# EAGLE design DCCGen_ATMEGA_V5 (EAGLE 6.2)
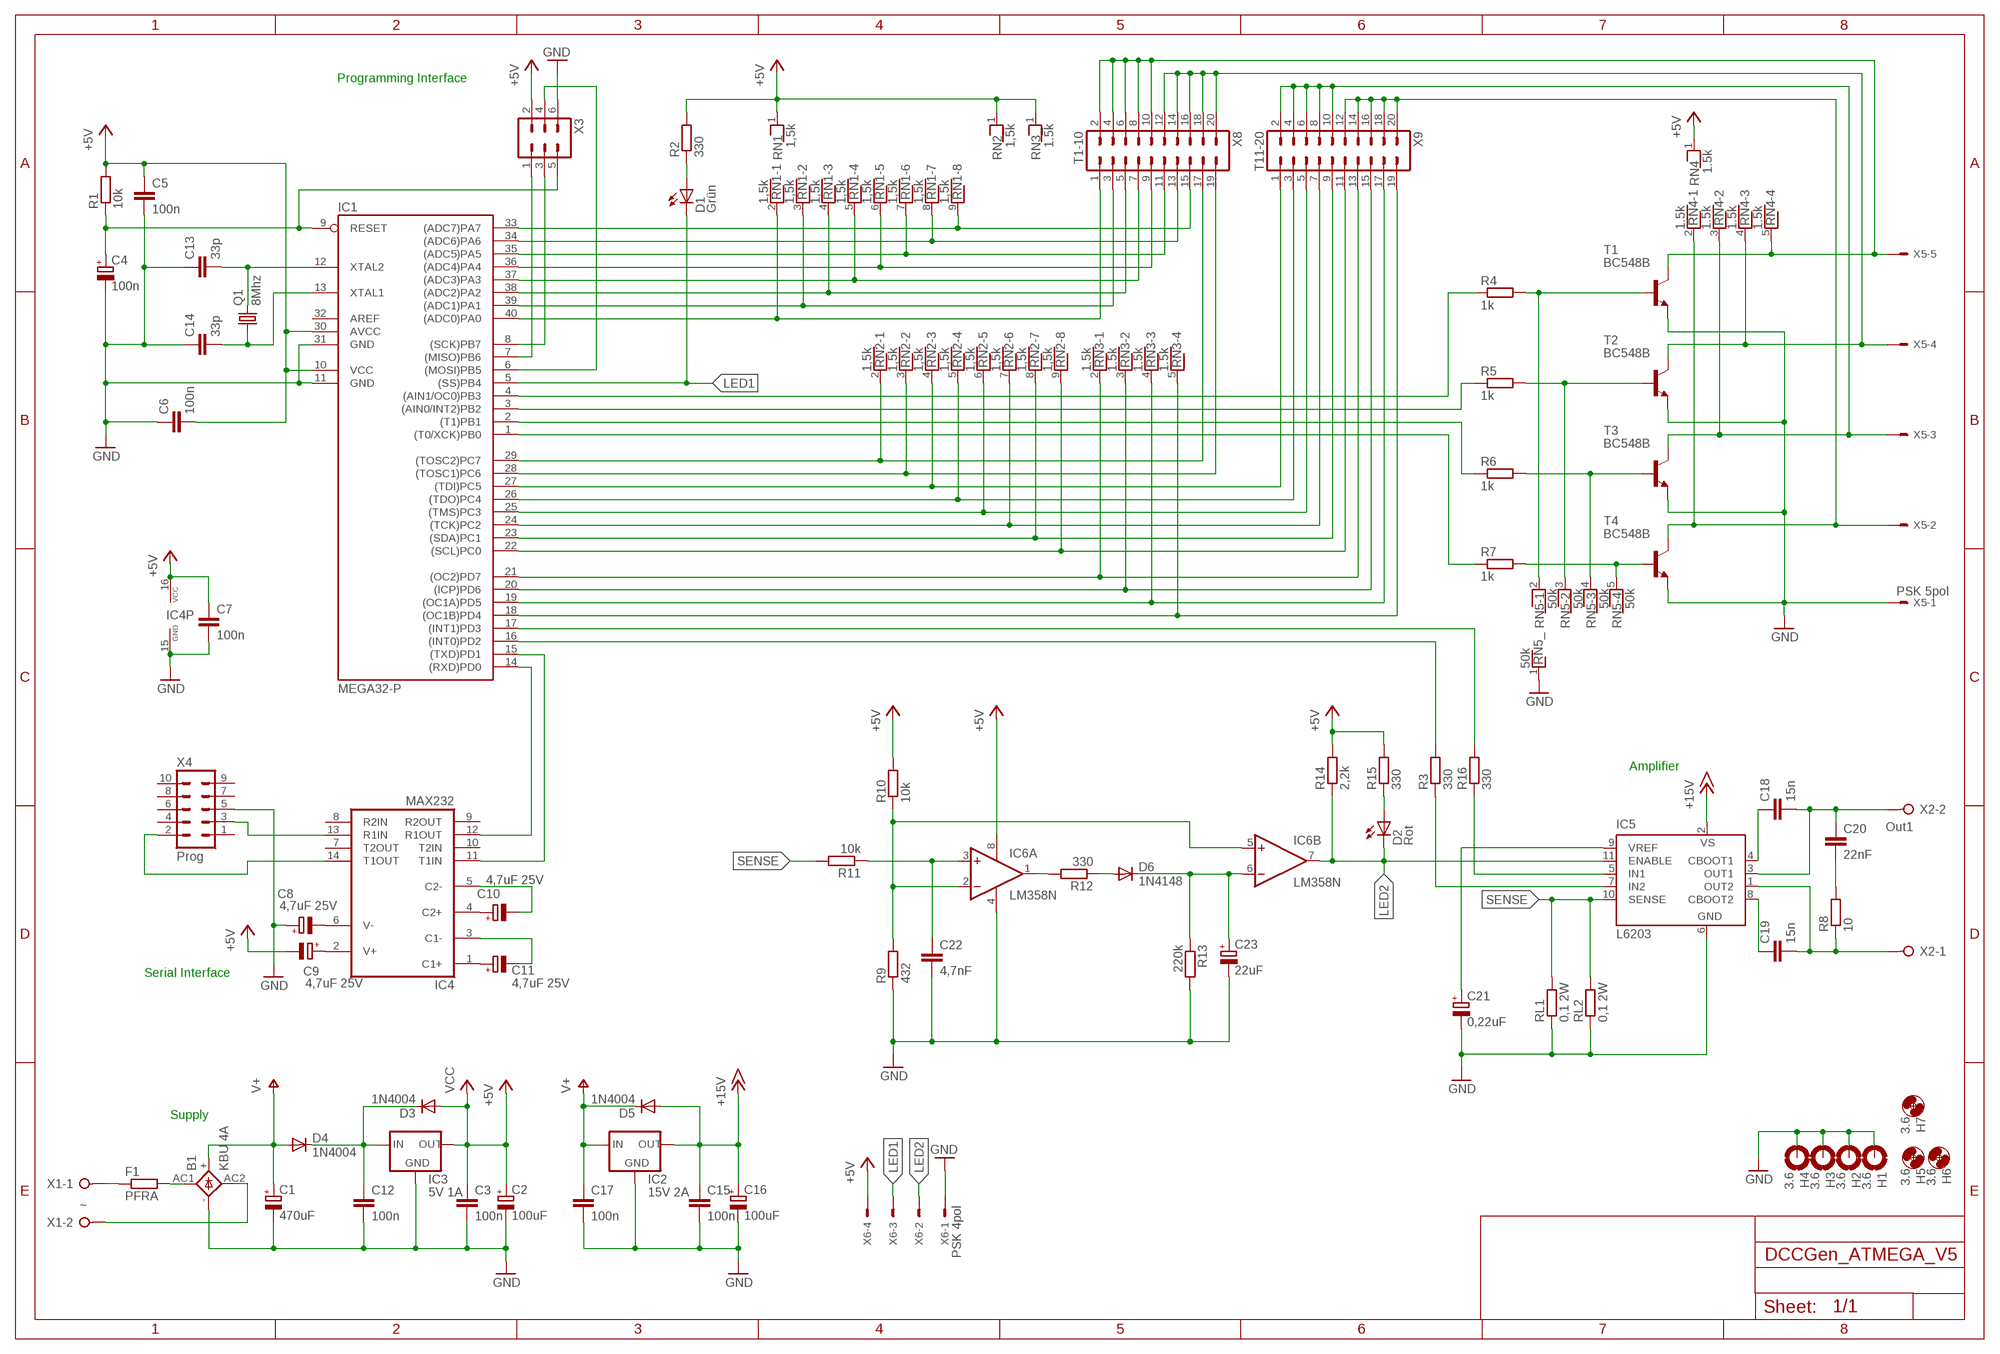
[diagram p0: schematic, sheet 1]

## Parts
B1  KBU 4A  KBU  [KBU]
C1  470uF  CPOL-EUE5-13  [E5-13]
C2  100uF  CPOL-EUE2.5-7  [E2,5-7]
C3  100n  C-EU025-025X050  [C025-025X050]
C4  100n  CPOL-EUE2.5-5  [E2,5-5]
C5  100n  C-EU025-025X050  [C025-025X050]
C6  100n  C-EU025-025X050  [C025-025X050]
C7  100n  C-EU025-025X050  [C025-025X050]
C8  4,7uF 25V  CPOL-EUE2,5-6E  [E2,5-6E]
C9  4,7uF 25V  CPOL-EUE2,5-6E  [E2,5-6E]
C10  4,7uF 25V  CPOL-EUE2,5-6E  [E2,5-6E]
C11  4,7uF 25V  CPOL-EUE2,5-6E  [E2,5-6E]
C12  100n  C-EU025-025X050  [C025-025X050]
C13  33p  C-EU025-025X050  [C025-025X050]
C14  33p  C-EU025-025X050  [C025-025X050]
C15  100n  C-EU025-025X050  [C025-025X050]
C16  100uF  CPOL-EUE2.5-7  [E2,5-7]
C17  100n  C-EU025-025X050  [C025-025X050]
C18  15n  C-EU025-025X050  [C025-025X050]
C19  15n  C-EU025-025X050  [C025-025X050]
C20  22nF  C-EU025-025X050  [C025-025X050]
C21  0,22uF  CPOL-EUE2-5  [E2-5]
C22  4,7nF  C-EU025-025X050  [C025-025X050]
C23  22uF  CPOL-EUE2-5  [E2-5]
D1  Grün  LED3MM  [LED3MM]
D2  Rot  LED3MM  [LED3MM]
D3  1N4004  [DO41-10]
D4  1N4004  [DO41-10]
D5  1N4004  [DO41-10]
D6  1N4148  1N4148DO35-10  [DO35-10]
F1  PFRA  R-EU_0204/5  [0204/5]
H1  3.6  MOUNT-PAD-ROUND3.6  [3,6-PAD]
H2  3.6  MOUNT-PAD-ROUND3.6  [3,6-PAD]
H3  3.6  MOUNT-PAD-ROUND3.6  [3,6-PAD]
H4  3.6  MOUNT-PAD-ROUND3.6  [3,6-PAD]
H5  3.6  MOUNT-HOLE3.6  [3,6]
H6  3.6  MOUNT-HOLE3.6  [3,6]
H7  3.6  MOUNT-HOLE3.6  [3,6]
IC1  MEGA32-P  [DIL40]
IC2  15V 2A  78XXS  [78XXS]
IC3  5V 1A  78XXS  [78XXS]
IC4  MAX232  [DIL16]
IC5  L6203  [MULTIWATT-11]
IC6  LM358N  [DIL08]
Q1  8Mhz  CRYSTALHC49U-V  [HC49U-V]
R1  10k  R-EU_0207/10  [0207/10]
R2  330  R-EU_0207/10  [0207/10]
R3  330  R-EU_0207/10  [0207/10]
R4  1k  R-EU_0207/10  [0207/10]
R5  1k  R-EU_0207/10  [0207/10]
R6  1k  R-EU_0207/10  [0207/10]
R7  1k  R-EU_0207/10  [0207/10]
R8  10  R-EU_0207/10  [0207/10]
R9  432  R-EU_0207/10  [0207/10]
R10  10k  R-EU_0207/10  [0207/10]
R11  10k  R-EU_0207/10  [0207/10]
R12  330  R-EU_0207/10  [0207/10]
R13  220k  R-EU_0207/10  [0207/10]
R14  2,2k  R-EU_0207/10  [0207/10]
R15  330  R-EU_0207/10  [0207/10]
R16  330  R-EU_0207/10  [0207/10]
RL1  0,1 2W  R-EU_0617/17  [0617/17]
RL2  0,1 2W  R-EU_0617/17  [0617/17]
RN1  1,5k  RNX8  [RN-9]
RN2  1,5k  RNX8  [RN-9]
RN3  1.5k  RNX4  [RN-5]
RN4  1.5k  RNX4  [RN-5]
RN5  50k  RNX4  [RN-5]
T1  BC548B  [TO92-EBC]
T2  BC548B  [TO92-EBC]
T3  BC548B  [TO92-EBC]
T4  BC548B  [TO92-EBC]
X1  ~  W237-02P  [W237-132]
X2  Out1  W237-02P  [W237-132]
X3  ML6  [ML6]
X4  Prog  ML10  [ML10]
X5  PSK 5pol  22-27-2051-05  [6410-05]
X6  PSK 4pol  22-27-2041-04  [6410-04]
X8  T1-10  ML20  [ML20]
X9  T11-20  ML20  [ML20]

## Nets
+5V: C2.+ C3.1 C5.1 C6.2 C7.1 C9.- D3.A IC1.10(VCC) IC1.30(AVCC) IC3.OUT IC4.16(VCC) IC6.8(P:V+) R1.2 R2.2 R10.2 R14.2 R15.2 RN1.1 RN2.1 RN3.1 RN4.1 X3.2 X6.4 ; supply symbol labelled VCC
+15V: C15.1 C16.+ D5.A IC2.OUT IC5.2(VS)
GND: B1.- C1.- C2.- C3.2 C4.- C5.2 C6.1 C7.2 C8.+ C12.2 C13.1 C14.1 C15.2 C16.- C17.2 C21.- C22.2 C23.- H1.B3,6(MOUNT) H2.B3,6(MOUNT) H3.B3,6(MOUNT) H4.B3,6(MOUNT) IC1.11(GND) IC1.31(GND) IC2.GND IC3.GND IC4.15(GND) IC5.6(GND) IC6.4(P:V-) R9.1 R13.2 RL1.1 RL2.1 RN5.1 T1.E T2.E T3.E T4.E X3.6 X4.5 X5.1 X6.1
LED1: D1.K(C) IC1.5((SS)PB4) X6.3
LED2: D2.K(C) IC5.11(ENABLE) IC6.7(B:OUT) R14.1 X6.2
N$1: F1.1 X1.1
N$2: B1.AC2 X1.2
N$3: IC1.6((MOSI)PB5) X3.4
N$4: IC1.8((SCK)PB7) X3.3
N$5: IC1.7((MISO)PB6) X3.1
N$6: IC1.40((ADC0)PA0) RN1.2 X8.1
N$7: IC1.39((ADC1)PA1) RN1.3 X8.3
N$8: IC1.38((ADC2)PA2) RN1.4 X8.5
N$9: C4.+ IC1.9(RESET) R1.1 X3.5
N$10: IC1.37((ADC3)PA3) RN1.5 X8.7
N$11: IC1.36((ADC4)PA4) RN1.6 X8.9
N$12: IC1.35((ADC5)PA5) RN1.7 X8.11
N$13: IC1.34((ADC6)PA6) RN1.8 X8.13
N$14: IC1.33((ADC7)PA7) RN1.9 X8.15
N$15: C14.2 IC1.13(XTAL1) Q1.1
N$16: C12.1 D3.C D4.C IC3.IN
N$17: D1.A R2.1
N$19: IC1.29((TOSC2)PC7) RN2.2 X8.17
N$20: IC1.28((TOSC1)PC6) RN2.3 X8.19
N$21: IC1.27((TDI)PC5) RN2.4 X9.1
N$22: C21.+ IC5.9(VREF)
N$23: IC1.26((TDO)PC4) RN2.5 X9.3
N$24: IC6.2(A:-IN) IC6.5(B:+IN) R9.2 R10.1
N$25: C22.1 IC6.3(A:+IN) R11.1
N$26: C20.2 R8.2
N$27: IC1.17((INT1)PD3) R16.2
N$28: IC1.16((INT0)PD2) R3.2
N$29: C18.2 C20.1 IC5.3(OUT1) X2.2
N$30: C18.1 IC5.4(CBOOT1)
N$31: IC1.15((TXD)PD1) IC4.11(T1IN)
N$32: IC1.14((RXD)PD0) IC4.12(R1OUT)
N$33: C8.- IC4.6(V-)
N$34: C9.+ IC4.2(V+)
N$35: IC4.14(T1OUT) X4.2
N$36: C11.+ IC4.1(C1+)
N$37: C11.- IC4.3(C1-)
N$38: C10.+ IC4.4(C2+)
N$39: C10.- IC4.5(C2-)
N$40: IC4.13(R1IN) X4.3
N$42: IC1.25((TMS)PC3) RN2.6 X9.5
N$43: B1.AC1 F1.2
N$44: IC1.24((TCK)PC2) RN2.7 X9.7
N$45: IC1.23((SDA)PC1) RN2.8 X9.9
N$47: IC1.22((SCL)PC0) RN2.9 X9.11
N$48: IC1.21((OC2)PD7) RN3.2 X9.13
N$49: IC1.20((ICP)PD6) RN3.3 X9.15
N$50: IC1.19((OC1A)PD5) RN3.4 X9.17
N$51: IC1.18((OC1B)PD4) RN3.5 X9.19
N$52: IC5.7(IN2) R3.1
N$53: IC5.5(IN1) R16.1
N$56: RN4.2 T4.C X5.2 X9.12 X9.14 X9.16 X9.18 X9.20
N$57: IC1.2((T1)PB1) R6.1
N$58: IC1.1((T0/XCK)PB0) R7.1
N$60: IC1.4((AIN1/OC0)PB3) R4.1
N$61: IC1.3((AIN0/INT2)PB2) R5.1
N$63: R4.2 RN5.2 T1.B
N$64: R5.2 RN5.3 T2.B
N$65: R6.2 RN5.4 T3.B
N$66: R7.2 RN5.5 T4.B
N$67: C13.2 IC1.12(XTAL2) Q1.2
N$68: C19.1 IC5.8(CBOOT2)
N$69: C19.2 IC5.1(OUT2) R8.1 X2.1
N$70: IC6.1(A:OUT) R12.2
N$72: C23.+ D6.C IC6.6(B:-IN) R13.1
N$73: D6.A R12.1
N$74: RN4.5 T1.C X5.5 X8.2 X8.4 X8.6 X8.8 X8.10
N$75: RN4.4 T2.C X5.4 X8.12 X8.14 X8.16 X8.18 X8.20
N$76: RN4.3 T3.C X5.3 X9.2 X9.4 X9.6 X9.8 X9.10
N$77: D2.A R15.1
SENSE: IC5.10(SENSE) R11.2 RL1.2 RL2.2
V+: B1.+ C1.+ C17.1 D4.A D5.C IC2.IN
Unconnected: IC1.32(AREF) IC4.7(T2OUT) IC4.8(R2IN) IC4.9(R2OUT) IC4.10(T2IN) X4.1 X4.4 X4.6 X4.7 X4.8 X4.9 X4.10

## Notes on the sheet
- Programming Interface
- Amplifier
- Serial Interface
- Supply

## Library data of the parts
B1 = rectifier:KBU: DIOTEC RECTIFIER
C1 C2 C4 C8-C11 C16 C21 C23 = rcl:CPOL-EU: POLARIZED CAPACITOR, European symbol
C3 C5-C7 C12-C15 C17-C20 C22 = rcl:C-EU: CAPACITOR, European symbol
D1 D2 = led:LED: LED OSRAM: - CHIPLED LG R971, LG N971, LY N971, LG Q971, LY Q971, LO R971, LY R971 LH N974, LH R974 LS Q976, LO Q976, LY Q976 LO Q996 - Hyper CHIPLED LW Q18S LB Q993, LB Q99A, LB R99A - SideLED LS A670, LO A670, LY A670, LG A670, LP A670 LB A673, LV A673, LT A673, LW A673 LH A674 LY A675 LS A676, LA A676, LO A676, LY A676, LW A676 LS A679, LY A679, LG A679 - Hyper Micro SIDELED® LS Y876, LA Y876, LO Y876, LY Y876 LT Y87S - SmartLED LW L88C, LW L88S LB L89C, LB L89S, LG L890 LS L89K, LO L89K, LY L89K LS L896, LA L896, LO L896, LY L896 - TOPLED LS T670, LO T670, LY T670, LG T670, LP T670 LSG T670, LSP T670, LSY T670, LOP T670, LYG T670 LG T671, LOG T671, LSG T671 LB T673, LV T673, LT T673, LW T673 LH T674 LS T676, LA T676, LO T676, LY T676, LB T676, LH T676, LSB T676, LW T676 LB T67C, LV T67C, LT T67C, LS T67K, LO T67K, LY T67K, LW E67C LS E67B, LA E67B, LO E67B, LY E67B, LB E67C, LV E67C, LT E67C LW T67C LS T679, LY T679, LG T679 LS T770, LO T770, LY T770, LG T770, LP T770 LB T773, LV T773, LT T773, LW T773 LH T774 LS E675, LA E675, LY E675, LS T675 LS T776, LA T776, LO T776, LY T776, LB T776 LHGB T686 LT T68C, LB T68C - Hyper Mini TOPLED® LB M676 - Mini TOPLED Santana® LG M470 LS M47K, LO M47K, LY M47K Source: http://www.osram.convergy.de LUXEON: - LUMILED® LXK2-PW12-R00, LXK2-PW12-S00, LXK2-PW14-U00, LXK2-PW14-V00 LXK2-PM12-R00, LXK2-PM12-S00, LXK2-PM14-U00 LXK2-PE12-Q00, LXK2-PE12-R00, LXK2-PE12-S00, LXK2-PE14-T00, LXK2-PE14-U00 LXK2-PB12-K00, LXK2-PB12-L00, LXK2-PB12-M00, LXK2-PB14-N00, LXK2-PB14-P00, LXK2-PB14-Q00 LXK2-PR12-L00, LXK2-PR12-M00, LXK2-PR14-Q00, LXK2-PR14-R00 LXK2-PD12-Q00, LXK2-PD12-R00, LXK2-PD12-S00 LXK2-PH12-R00, LXK2-PH12-S00 LXK2-PL12-P00, LXK2-PL12-Q00, LXK2-PL12-R00 Source: www.luxeon.com KINGBRIGHT: KA-3528ASYC Source: www.kingbright.com
D3-D5 = diode:1N4004: DIODE general purpose rectifier, 1 A
D6 = diode:1N4148: DIODE high speed (Philips)
F1 R1-R16 RL1 RL2 = rcl:R-EU_: RESISTOR, European symbol
H1-H4 = holes:MOUNT-PAD-ROUND: MOUNTING PAD, round
H5-H7 = holes:MOUNT-HOLE: MOUNTING HOLE with drill center marker
IC1 = atmel:MEGA32-P: MICROCONTROLLER 32 Kbytes FLASH 2 Kbytes SRAM 1 Kbytes EEPROM USART 8-channel 10 bit ADC Source: www.atmel.com .. doc2503.pdf; MPN: ATMEGA32-16PU; OC_FARNELL: 1661729; OC_NEWARK: 51P1794
IC2 IC3 = v-reg:78XXS: VOLTAGE REGULATOR
IC4 = maxim:MAX232: RS232 TRANSEIVER
IC5 = st-microelectronics:L6203: DMOS FULL BRIDGE DRIVER; MPN: L6203; OC_FARNELL: 1467715; OC_NEWARK: 56P8434
IC6 = linear:LM358: OP AMP also LM158; LM258; LM2904 Source: http://cache.national.com/ds/LM/LM158.pdf
Q1 = crystal:CRYSTAL: CRYSTAL; OC_FARNELL: 1666969; OC_NEWARK: unknown
RN1 RN2 = resistor-net:RNX8: RESISTOR NETWORK; OC_FARNELL: unknown; OC_NEWARK: unknown
RN3-RN5 = resistor-net:RNX4: RESISTOR NETWORK; OC_FARNELL: unknown; OC_NEWARK: unknown
T1-T4 = transistor-npn:BC548*: NPN Transistor
X1 X2 = con-wago-508:W237-02P: WAGO SREW CLAMP; OC_FARNELL: unknown; OC_NEWARK: unknown
X3 = con-ml:ML6: HARTING; OC_FARNELL: unknown; OC_NEWARK: unknown
X4 = con-ml:ML10: HARTING; OC_FARNELL: unknown; OC_NEWARK: unknown
X5 = con-molex:22-?-05: CONNECTOR wire to board 2.54 mm (.1 inch) pitch header; OC_FARNELL: unknown; OC_NEWARK: unknown
X6 = con-molex:22-?-04: CONNECTOR wire to board 2.54 mm (.1 inch) pitch header; OC_FARNELL: unknown; OC_NEWARK: unknown
X8 X9 = con-ml:ML20: HARTING; OC_FARNELL: unknown; OC_NEWARK: unknown

## Board
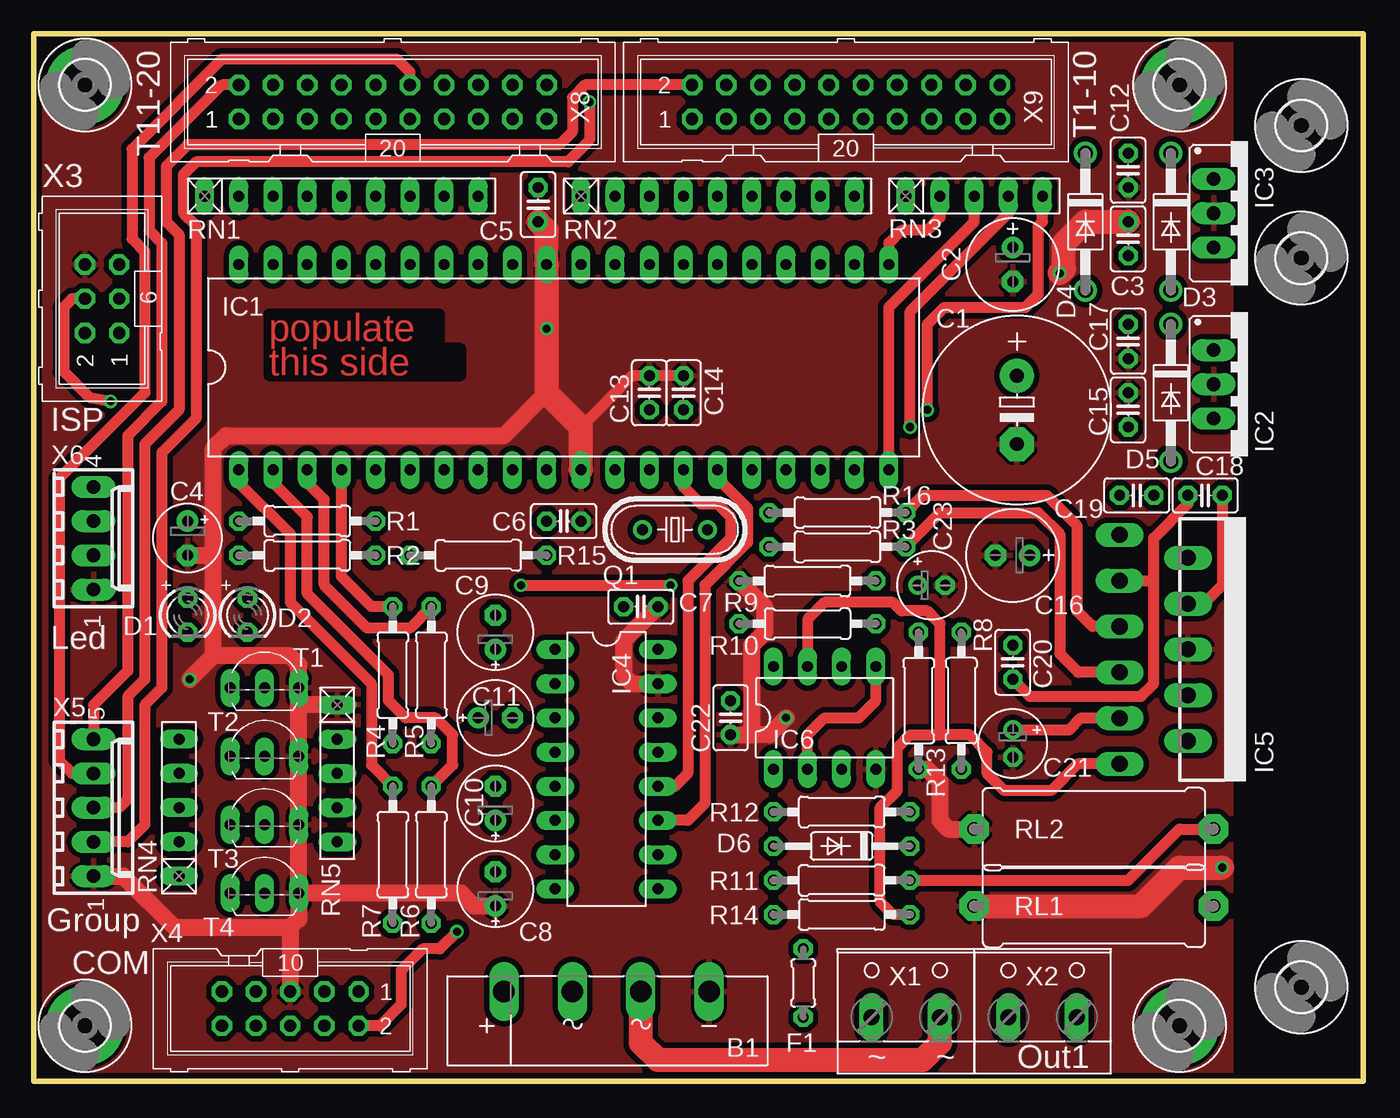
[diagram p1: board, top side]
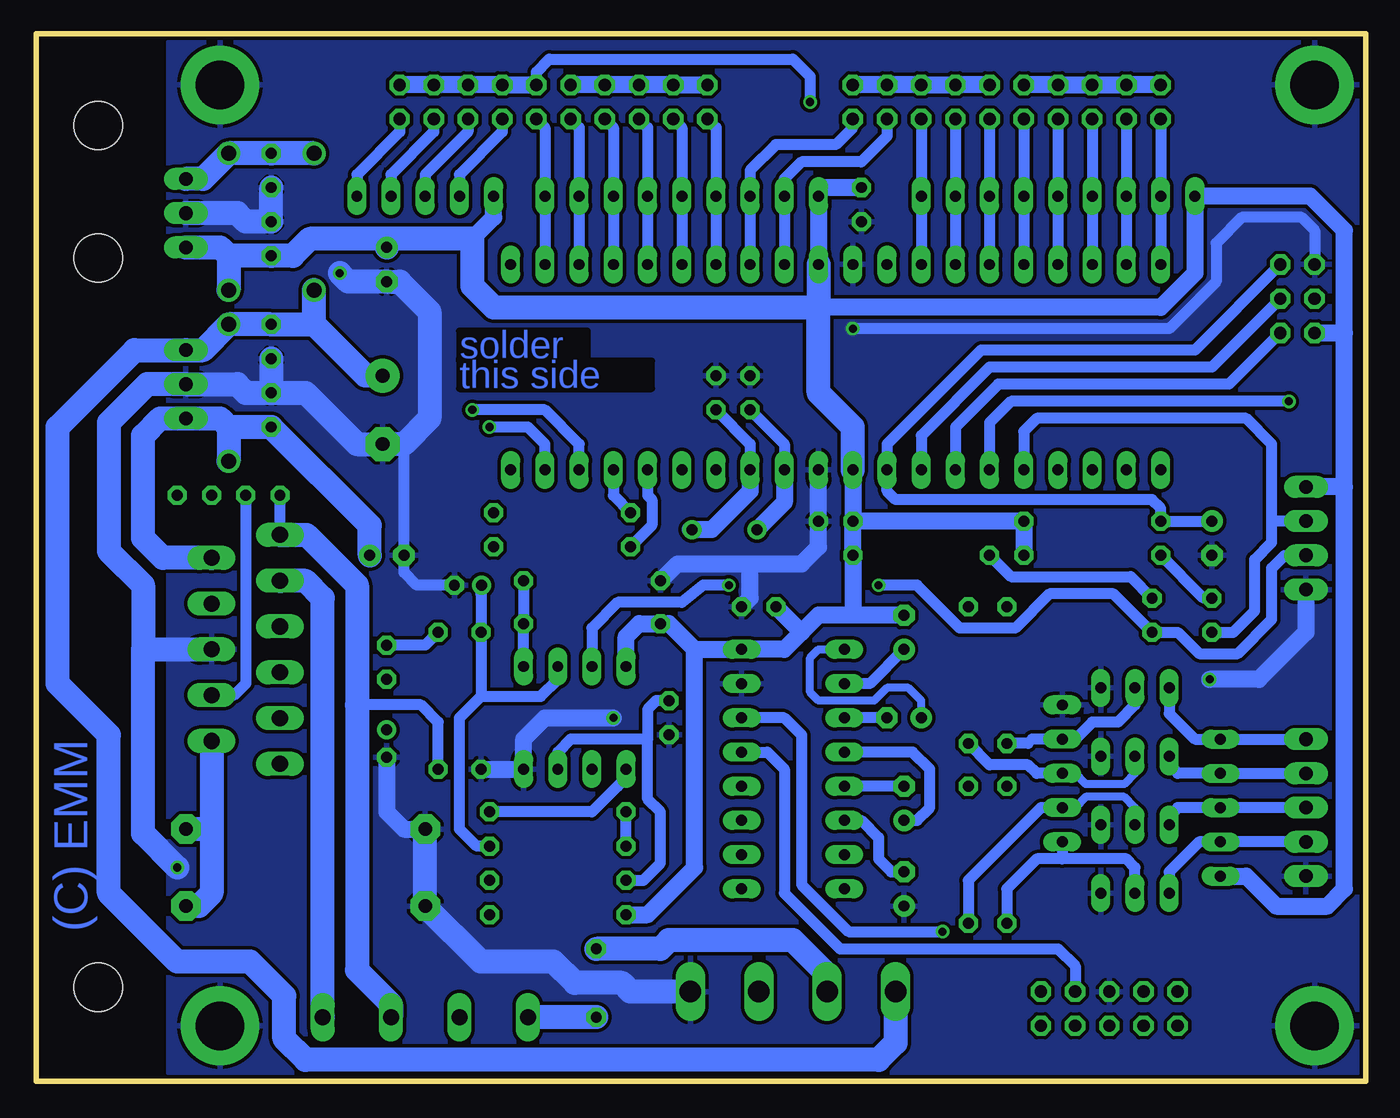
[diagram p2: board, bottom side, seen from below]

Size 98.73 x 77.78 mm. Coordinates in mm from the lower left corner, seen from the top.
Outline: 0,0 98.73,0 98.73,77.78 0,77.78 0,0
Copper layers (1*16): Top 0.035mm / dielectric 1.5mm / Bottom 0.035mm
Design rules: minimum track width 0.2mm, minimum drill 0.5mm, track to track 0.2mm, track to pad 0.2mm, pad to pad 0.15mm, via to via 0.2mm, smd to smd 0mil, copper to edge 0.2mm, drill to drill 0.2mm, minimum pad ring 0.3mm, minimum via ring 0.2mm, stop-mask expansion 0.1mm, vias tented up to drill 0mil, thermal gap 10mil

### Footprints (pad centres in the part's own frame; a part is rotated, then mirrored left to right if it is on the bottom)
KBU = drill 1.6 long: + -7.62,2.54; - 7.62,2.54; AC1 -2.54,2.54; AC2 2.54,2.54
E5-13 = drill 1.016 pad 2.54: + -2.54,0 | drill 1.016 pad 2.54 octagon: - 2.54,0
E2,5-7 = drill 0.813 pad 1.6: + -1.27,0 | drill 0.813 pad 1.6 octagon: - 1.27,0
C025-025X050 = drill 0.813 octagon: 1 -1.27,0; 2 1.27,0
E2,5-5 = drill 0.813 pad 1.6: + -1.27,0 | drill 0.813 pad 1.6 octagon: - 1.27,0
E2,5-6E = drill 0.813 pad 1.575: + -1.27,0 | drill 0.813 pad 1.575 octagon: - 1.27,0
E2-5 = drill 0.813 pad 1.27: + -1.016,0 | drill 0.813 pad 1.27 octagon: - 1.016,0
LED3MM = drill 0.813 octagon: A -1.27,0; K 1.27,0
DO41-10 = drill 1.118: A 5.08,0; C -5.08,0
DO35-10 = drill 0.813 octagon: A 5.08,0; C -5.08,0
0204/5 = drill 0.813 octagon: 1 -2.54,0; 2 2.54,0
3,6-PAD = drill 3.6 pad 5.842: B3,6 0,0
3,6 = hole 3.6: 0,0
DIL40 = drill 0.813 long: 1 -24.13,-7.62; 2 -21.59,-7.62; 3 -19.05,-7.62; 4 -16.51,-7.62; 5 -13.97,-7.62; 6 -11.43,-7.62; 7 -8.89,-7.62; 8 -6.35,-7.62; 9 -3.81,-7.62; 10 -1.27,-7.62; 11 1.27,-7.62; 12 3.81,-7.62; 13 6.35,-7.62; 14 8.89,-7.62; 15 11.43,-7.62; 16 13.97,-7.62; 17 16.51,-7.62; 18 19.05,-7.62; 19 21.59,-7.62; 20 24.13,-7.62; 21 24.13,7.62; 22 21.59,7.62; 23 19.05,7.62; 24 16.51,7.62; 25 13.97,7.62; 26 11.43,7.62; 27 8.89,7.62; 28 6.35,7.62; 29 3.81,7.62; 30 1.27,7.62; 31 -1.27,7.62; 32 -3.81,7.62; 33 -6.35,7.62; 34 -8.89,7.62; 35 -11.43,7.62; 36 -13.97,7.62; 37 -16.51,7.62; 38 -19.05,7.62; 39 -21.59,7.62; 40 -24.13,7.62
78XXS = drill 1.016 long: GND 0,-2.54; IN -2.54,-2.54; OUT 2.54,-2.54
DIL16 = drill 0.813 long: 1 -8.89,-3.81; 2 -6.35,-3.81; 3 -3.81,-3.81; 4 -1.27,-3.81; 5 1.27,-3.81; 6 3.81,-3.81; 7 6.35,-3.81; 8 8.89,-3.81; 9 8.89,3.81; 10 6.35,3.81; 11 3.81,3.81; 12 1.27,3.81; 13 -1.27,3.81; 14 -3.81,3.81; 15 -6.35,3.81; 16 -8.89,3.81
MULTIWATT-11 = drill 1.2 long: 1 -8.5,-6.35; 2 -6.8,-1.27; 3 -5.1,-6.35; 4 -3.4,-1.27; 5 -1.7,-6.35; 6 0,-1.27; 7 1.7,-6.35; 8 3.4,-1.27; 9 5.1,-6.35; 10 6.8,-1.27; 11 8.5,-6.35
DIL08 = drill 0.813 pad 1.27 long: 1 -3.81,-3.81; 2 -1.27,-3.81; 3 1.27,-3.81; 4 3.81,-3.81; 5 3.81,3.81; 6 1.27,3.81; 7 -1.27,3.81; 8 -3.81,3.81
HC49U-V = drill 0.813: 1 -2.413,0; 2 2.413,0
0207/10 = drill 0.813 octagon: 1 -5.08,0; 2 5.08,0
0617/17 = drill 1.016 pad 2.184 octagon: 1 -8.89,0; 2 8.89,0
RN-9 = drill 0.813 long: 1 -10.16,0; 2 -7.62,0; 3 -5.08,0; 4 -2.54,0; 5 0,0; 6 2.54,0; 7 5.08,0; 8 7.62,0; 9 10.16,0
RN-5 = drill 0.813 long: 1 -5.08,0; 2 -2.54,0; 3 0,0; 4 2.54,0; 5 5.08,0
TO92-EBC = drill 0.813 long: B 0,-1.27; C -2.54,-1.27; E 2.54,-1.27
W237-132 = drill 1.194 long: 1 -2.54,-0.635; 2 2.54,-0.635
ML6 = drill 0.914 octagon: 1 -2.54,-1.27; 2 -2.54,1.27; 3 0,-1.27; 4 0,1.27; 5 2.54,-1.27; 6 2.54,1.27
ML10 = drill 0.914 octagon: 1 -5.08,-1.27; 2 -5.08,1.27; 3 -2.54,-1.27; 4 -2.54,1.27; 5 0,-1.27; 6 0,1.27; 7 2.54,-1.27; 8 2.54,1.27; 9 5.08,-1.27; 10 5.08,1.27
6410-05 = drill 1.016 long: 1 5.08,0; 2 2.54,0; 3 0,0; 4 -2.54,0; 5 -5.08,0
6410-04 = drill 1.016 long: 1 3.81,0; 2 1.27,0; 3 -1.27,0; 4 -3.81,0
ML20 = drill 0.914 octagon: 1 -11.43,-1.27; 2 -11.43,1.27; 3 -8.89,-1.27; 4 -8.89,1.27; 5 -6.35,-1.27; 6 -6.35,1.27; 7 -3.81,-1.27; 8 -3.81,1.27; 9 -1.27,-1.27; 10 -1.27,1.27; 11 1.27,-1.27; 12 1.27,1.27; 13 3.81,-1.27; 14 3.81,1.27; 15 6.35,-1.27; 16 6.35,1.27; 17 8.89,-1.27; 18 8.89,1.27; 19 11.43,-1.27; 20 11.43,1.27

### Placement (x,y rotation side)
B1  42.55,4.13 0 top
C1  73.03,49.85 270 top
C2  72.71,60.64 270 top
C3  81.28,62.55 90 top
C4  11.43,40.32 270 top
C5  37.46,65.09 270 top
C6  39.37,41.59 180 top
C7  45.09,35.24 0 top
C8  34.29,14.29 90 top
C9  34.29,33.34 90 top
C10  34.29,20.64 90 top
C11  34.29,26.99 0 top
C12  81.28,67.63 270 top
C13  45.72,51.12 270 top
C14  48.26,51.12 270 top
C15  81.28,49.85 90 top
C16  72.71,39.05 180 top
C17  81.28,54.93 270 top
C18  87,43.5 180 top
C19  81.91,43.5 180 top
C20  72.71,31.12 90 top
C21  72.71,25.08 270 top
C22  51.75,26.99 270 top
C23  66.67,36.83 0 top
D1  11.43,34.61 270 top
D2  15.88,34.61 270 top
D3  84.45,63.82 270 top
D4  78.11,63.82 270 top
D5  84.45,51.12 270 top
D6  60.01,17.46 180 top
F1  57.15,7.3 90 top
H1  3.81,73.98 0 top
H2  3.81,4.13 0 top
H3  85.09,73.98 0 top
H4  85.09,4.13 0 top
H5  94.14,70.96 0 top
H6  94.14,6.99 0 top
H7  94.14,61.12 0 top
IC1  39.37,53.02 0 top
IC2  90.17,51.75 270 top
IC3  90.17,64.45 270 top
IC4  42.55,23.18 270 top
IC5  87,32.07 270 top
IC6  58.74,26.99 0 top
Q1  47.62,40.96 180 top
R1  20.32,41.59 0 top
R2  20.32,39.05 0 top
R3  59.69,39.69 180 top
R4  26.67,30.16 270 top
R5  29.53,30.16 270 top
R6  29.53,16.83 270 top
R7  26.67,16.83 270 top
R8  68.9,28.26 90 top
R9  57.47,37.15 0 top
R10  57.47,33.97 180 top
R11  60.01,14.92 0 top
R12  60.01,20 0 top
R13  65.72,28.26 270 top
R14  60.01,12.38 180 top
R15  33.02,39.05 0 top
R16  59.69,42.23 180 top
RL1  78.74,13.02 0 top
RL2  78.74,18.73 0 top
RN1  22.86,65.72 0 top
RN2  50.8,65.72 0 top
RN3  69.85,65.72 0 top
RN4  10.79,20.32 90 top
RN5  22.54,22.86 270 top
T1  17.14,30.48 0 top
T2  17.14,25.4 0 top
T3  17.14,20.32 0 top
T4  17.14,15.24 0 top
X1  64.77,5.4 0 top
X2  74.93,5.4 0 top
X3  5.08,58.1 90 top
X4  19.05,5.4 180 top
X5  4.44,20.32 270 top
X6  4.44,40.32 270 top
X8  26.67,72.71 0 top
X9  60.32,72.71 0 top

### Tracks (layer width: path | path; a pad name or v marks a point on that pad's centre or on a via)
+5V
  Bottom 1.27: IC1.30 RN2.1 40.64,66.36 C5.1 | 66.36,62.55 64.77,64.14 RN3.1 | IC1.10 C6.2 | 40.64,57.47 15.24,57.47 12.7,60.01 RN1.1 4.13,65.72 1.59,63.18 1.59,55.56 | IC6.8 54.93,33.02 53.98,33.97 R10.2 51.75,33.97 49.85,32.07 | 49.85,32.07 IC4.16 43.18,32.07 41.91,33.34 | R14.2 53.34,12.38 49.85,15.88 49.85,32.07 | RN4.1 8.89,15.24 6.67,13.02 2.86,13.02 1.59,14.29 1.59,44.13 | C9.- 38.1,34.61 | 38.1,34.61 40.64,34.61 41.91,33.34 | 38.1,34.61 R15.2 C6.2 | R2.2 R1.2 C6.2 | C7.1 41.91,33.34 | 1.59,44.13 X6.4 | 1.59,44.13 1.59,55.56 | X3.2 1.59,55.56
  Bottom 1.778: IC1.10 38.1,48.58 40.64,51.12 40.64,57.47 | IC1.30 40.64,57.47 | IC3.OUT 85.09,61.91 84.45,61.28 | 84.45,61.28 D3.A | 84.45,61.28 C3.1 79.69,61.28 78.42,62.55 72.71,62.55 | 40.64,57.47 64.77,57.47 66.36,59.05 66.36,62.55 72.71,62.55 | C2.+ 72.71,62.55
+15V
  Bottom 1.778: 84.45,48.58 85.09,49.21 IC2.OUT 89.53,49.21 90.8,47.94 90.8,40.32 89.35,38.87 IC5.2 | 84.45,48.58 D5.A | 84.45,48.58 C15.1 73.98,41.27 C16.+
GND  (via drill 0.6)
  Top 0.813: C14.1 C13.1 44.45,52.39 40.64,48.58
  Top 1.27: v11.59,29.85 13.34,31.59 | 13.34,31.59 13.34,39.05 | C7.2 43.81,32.7 43.81,30.16 44.45,29.53 IC4.15 | R13.2 66.36,23.18 67.31,22.22 67.31,19.37 67.94,18.73 RL2.1 | T4.E T3.E T2.E 19.68,27.94 | 19.68,27.94 T1.E 19.68,30.96 19.05,31.59 13.34,31.59 | RN5.1 19.68,27.94 | C4.- 13.34,39.05 | 13.34,39.05 13.34,46.99 14.29,47.94 34.92,47.94 38.1,51.12 | T4.E 19.68,12.06 19.05,11.43 | 19.05,11.43 X4.5 | C8.+ 32.7,13.02 31.75,13.97 T4.E | X5.1 6.67,15.24 10.48,11.43 19.05,11.43 | C22.2 53.34,25.72 | v55.88,26.99 54.61,25.72 53.34,25.72 | 53.34,25.72 53.34,32.38 54.29,33.34 54.29,35.24 R9.1
  Top 1.778: IC1.11 40.64,48.58 38.1,51.12 v38.1,55.88 IC1.31 38.1,63.18 C5.2 | RL1.1 82.23,13.02 85.09,15.88 v88.27,15.88 | v76.2,60.01 76.52,60.33 76.52,62.23 78.11,63.82 C3.2
  Bottom 0.813: v38.1,55.88 14.61,55.88 11.11,59.37 11.11,62.23 9.21,64.14 4.76,64.14 3.81,63.18 X3.6 | C23.- 70.48,36.83 71.44,37.78 C16.- 71.44,47.31
  Bottom 1.27: IC1.11 C6.1 40.64,39.69 41.91,38.42 45.72,38.42 | X6.1 4.44,33.34 7.94,29.85 v11.59,29.85 | C21.- 72.71,20 71.44,18.73 RL2.1 | R13.2 IC6.4 62.55,25.4 60.96,26.99 v55.88,26.99 | C7.2 45.72,35.88 45.72,38.42 | R9.1 51.12,38.42 45.72,38.42
  Bottom 1.778: 90.8,32.07 90.8,36.83 93.34,39.37 93.34,48.9 90.49,51.75 IC2.GND 83.82,51.75 83.19,51.12 C15.2 | B1.- 54.61,6.67 55.24,7.3 58.74,7.3 60.32,8.89 65.72,8.89 RL1.1 RL2.1 | v88.27,15.88 90.8,18.41 90.8,32.07 | 90.8,32.07 IC5.6 | C15.2 78.74,51.12 74.93,47.31 C1.- 71.44,47.31 69.53,49.21 69.53,57.15 71.75,59.37 C2.- 75.56,59.37 v76.2,60.01 | IC3.GND 83.82,64.45 83.19,63.82 C3.2 C12.2 | C17.2 C15.2
  pour Bottom (isolate 0.254): 0.64,77.15 88.9,77.15 88.9,0.63 0.64,0.63
  pour Top (isolate 0.406): 0.64,77.15 88.9,77.15 88.9,0.63 0.64,0.63
LED1
  Bottom 0.813: 6.99,41.59 6.99,47.31 8.89,49.21 24.45,49.21 25.4,48.26 IC1.5 | X6.3 6.99,41.59 | D1.K 9.84,33.34 8.26,34.93 8.26,38.73 6.99,40.01 6.99,41.59
LED2  (via drill 0.6)
  Top 0.813: IC5.11 77.54,23.57 75.56,21.59 72.07,21.59 70.8,22.86 70.8,24.45 69.53,25.72 67.31,25.72 | 67.31,25.72 67.31,33.97 66.36,34.93 64.45,34.93 63.82,35.56 58.74,35.56 57.47,34.29 IC6.7 | R14.1 63.82,12.38 62.86,13.33 62.86,20.32 64.14,21.59 64.14,24.76 65.09,25.72 67.31,25.72 | v36.2,36.83 v47.31,36.83
  Bottom 0.813: X6.2 6.03,39.05 6.99,38.1 6.99,34.29 9.53,31.75 12.38,31.75 13.97,33.34 D2.K 18.73,36.19 23.49,36.19 26.04,33.65 30.16,33.65 33.34,36.83 v36.2,36.83 | v47.31,36.83 49.21,36.83 50.8,35.56 55.56,35.56 57.47,33.65 IC6.7
N$1
  Bottom 1.778: F1.1 X1.1
N$2
  Top 1.778: B1.AC2 45.09,2.86 46.35,1.59 66.04,1.59 67.31,2.86 X1.2
N$3  (via drill 0.6)
  Top 0.813: X3.4 2.86,58.1 2.22,57.47 2.22,52.7 4.13,50.8 v5.71,50.48
  Bottom 0.813: v5.71,50.48 26.35,50.48 27.94,48.9 IC1.6
N$4
  Bottom 0.813: IC1.8 33.02,47.94 27.94,53.02 11.43,53.02 X3.3
N$5
  Bottom 0.813: X3.1 10.16,51.75 27.3,51.75 30.48,48.58 IC1.7
N$6
  Bottom 0.813: X8.1 RN1.2 IC1.40
N$7
  Bottom 0.813: X8.3 RN1.3 IC1.39
N$8
  Bottom 0.813: X8.5 RN1.4 IC1.38
N$9
  Bottom 0.813: C4.+ R1.1 15.24,42.55 15.88,43.18 34.92,43.18 35.56,43.82 IC1.9 35.56,47.31 28.57,54.29 12.7,54.29 X3.5
N$10
  Bottom 0.813: X8.7 RN1.5 IC1.37
N$11
  Bottom 0.813: X8.9 RN1.6 IC1.36
N$12
  Bottom 0.813: X8.11 RN1.7 IC1.35
N$13
  Bottom 0.813: X8.13 RN1.8 IC1.34
N$14
  Bottom 0.813: X8.15 RN1.9 IC1.33
N$15
  Bottom 0.813: C14.2 45.72,47.31 IC1.13
  Bottom 1.27: IC1.13 45.72,43.82 48.58,40.96 Q1.1 50.16,40.96
N$16
  Bottom 1.778: IC3.IN 86.36,66.99 D3.C C12.1 D4.C
N$17
  Bottom 0.813: D1.A 12.07,35.88 R2.1
N$19
  Bottom 0.813: X8.17 35.56,70.17 37.46,68.26 41.91,68.26 43.18,66.99 RN2.2 IC1.29
N$20
  Bottom 0.813: X8.19 38.1,70.8 39.37,69.53 43.81,69.53 45.72,67.63 RN2.3 IC1.28
N$21
  Bottom 0.813: X9.1 48.26,70.8 RN2.4 IC1.27
N$22
  Top 0.813: C21.+ 76.9,26.1 77.79,26.99 80.62,26.99 IC5.9
N$23
  Bottom 0.813: X9.3 50.8,70.8 RN2.5 IC1.26
N$24
  Top 0.813: IC6.2 57.47,25.72 58.74,26.99 61.28,26.99 62.55,28.26 IC6.5
  Bottom 0.813: R9.2 R10.1 IC6.5
N$25
  Bottom 0.813: C22.1 52.7,28.26 53.34,27.62 53.34,25.4 | 53.34,25.4 59.05,25.4 60.01,24.45 IC6.3 | R11.1 53.66,14.92 52.39,16.19 52.39,20 53.34,20.96 53.34,25.4
N$26
  Bottom 0.813: R8.2 69.85,32.38 C20.2
N$27
  Bottom 0.813: IC1.17 55.88,43.5 R16.2
N$28
  Bottom 0.813: IC1.16 53.34,43.5 53.02,43.18 53.02,41.27 R3.2
N$29
  Top 0.813: C18.2 85.72,42.86 83.19,40.32 83.19,37.15 | C20.1 73.98,28.58 82.23,28.58 83.19,29.53 83.19,37.15 | IC5.3 82.85,37.17 83.19,37.15
  Bottom 1.778: X2.2 77.47,35.88 78.74,37.15 80.62,37.15 IC5.3
N$30
  Top 0.813: C18.1 88.27,36.83 86.9,35.47 IC5.4
N$31
  Top 0.813: IC1.15 50.8,44.77 53.02,42.55 53.02,40.01 49.85,36.83 49.85,20.64 48.58,19.37 IC4.11
N$32
  Top 0.813: IC1.14 48.26,44.13 49.53,42.86 50.8,42.86 51.75,41.91 51.75,40.32 48.58,37.15 48.58,22.86 47.62,21.91 IC4.12
N$33
  Bottom 0.813: IC4.6 37.46,19.37 36.2,18.1 36.2,16.51 35.24,15.56 C8.-
N$34
  Bottom 0.813: C9.+ 36.83,29.53 IC4.2
N$35  (via drill 0.6)
  Top 0.813: v31.43,11.11 30.16,9.84 28.89,9.84 27.3,8.25 27.3,5.71 25.72,4.13 X4.2
  Bottom 0.813: v31.43,11.11 38.42,11.11 41.91,14.61 41.91,25.72 43.18,26.99 IC4.14
N$36
  Bottom 0.61: C11.+ 33.02,28.26 33.97,29.21 35.56,29.21 36.51,28.26 40.64,28.26 41.27,28.89 41.27,31.43 40.64,32.07 IC4.1
N$37
  Bottom 0.813: C11.- IC4.3
N$38
  Bottom 0.813: C10.+ 33.34,19.37 32.38,20.32 32.38,23.18 33.66,24.45 IC4.4
N$39
  Bottom 0.813: C10.- IC4.5
N$40
  Bottom 0.813: IC4.13 44.45,24.45 43.18,23.18 43.18,13.97 39.05,9.84 22.86,9.84 21.59,8.57 X4.3
N$42
  Bottom 0.813: X9.5 53.34,70.8 RN2.6 IC1.25
N$43
  Bottom 1.778: B1.AC1 40,7.94 42.55,10.48 51.75,10.48 52.39,9.84 F1.2
N$44
  Bottom 0.813: X9.7 55.88,70.8 RN2.7 IC1.24
N$45
  Bottom 0.813: X9.9 58.42,70.8 RN2.8 IC1.23
N$47
  Bottom 0.813: X9.11 60.96,70.8 RN2.9 IC1.22
N$48
  Top 0.813: RN3.2 67.31,64.14 66.36,63.18 64.45,63.18 63.5,62.23 IC1.21
  Bottom 0.813: X9.13 64.14,70.48 67.31,67.31 RN3.2
N$49
  Top 0.813: IC1.20 63.5,57.47 69.85,63.82 RN3.3
  Bottom 0.813: X9.15 66.67,70.48 69.85,67.31 RN3.3
N$50  (via drill 0.6)
  Top 0.813: v65.09,48.58 65.09,57.15 72.39,64.45 RN3.4
  Bottom 0.813: X9.17 69.22,70.48 72.39,67.31 RN3.4 | IC1.19 60.96,47.31 62.23,48.58 v65.09,48.58
N$51  (via drill 0.6)
  Top 0.813: v66.36,49.85 66.36,56.2 67.63,57.47 73.66,57.47 74.61,58.42 74.61,63.5 74.93,63.82 RN3.5
  Bottom 0.813: X9.19 71.75,70.48 74.93,67.31 RN3.5 | IC1.18 58.42,47.31 60.96,49.85 v66.36,49.85
N$52
  Top 0.813: R3.1 67.31,42.23 74.61,42.23 76.2,40.64 76.2,31.75 77.58,30.37 IC5.7
N$53
  Top 0.813: R16.1 66.04,43.5 75.25,43.5 77.47,41.27 77.47,34.93 78.63,33.77 IC5.5
N$56  (via drill 0.6)
  Top 0.813: v41.27,72.71 41.27,69.85 39.69,68.26 12.07,68.26 11.11,67.31 11.11,64.45 12.07,63.5 12.07,49.21 9.53,46.67 9.53,29.21 8.26,27.94 8.26,19.05 6.99,17.78 X5.2
  Bottom 0.813: X5.2 RN4.2 12.38,17.78 14.61,15.56 T4.C | X9.12 61.59,74.93 60.64,75.88 42.55,75.88 41.27,74.61 v41.27,72.71
  Bottom 1.27: X9.12 X9.14 X9.16 X9.18 X9.20
N$57
  Top 0.813: R6.1 31.12,23.49 31.12,25.72 29.84,26.99 27.62,26.99 26.35,28.26 26.35,30.16 20.32,36.19 20.32,41.91 17.78,44.45 IC1.2
N$58
  Top 0.813: IC1.1 15.24,44.45 19.05,40.64 19.05,35.56 25.08,29.53 25.08,23.49 R7.1
N$60
  Top 0.813: R4.1 25.08,35.24 22.86,37.47 IC1.4
N$61
  Top 0.813: R5.1 27.94,33.65 24.77,33.65 21.59,36.83 21.59,43.18 20.32,44.45 IC1.3
N$63
  Bottom 0.813: T1.B 17.14,27.94 18.41,26.67 20.32,26.67 21.59,25.4 RN5.2 24.77,25.4 25.08,25.08 R4.2
N$64
  Bottom 0.61: T2.B 17.14,22.86 17.94,22.07 20.8,22.07 21.59,22.86 RN5.3
  Bottom 0.813: RN5.3 24.45,22.86 25.08,23.49 27.94,23.49 R5.2
N$65
  Bottom 0.61: T3.B 17.14,20.32 17.94,21.11 20.8,21.11 21.59,20.32 RN5.4
  Bottom 0.813: RN5.4 24.13,20.32 29.53,14.92 R6.2
N$66
  Bottom 0.813: T4.B 17.14,15.88 17.78,16.51 22.54,16.51 | RN5.5 22.54,16.51 | 22.54,16.51 24.45,16.51 26.67,14.29 R7.2
N$67
  Bottom 0.813: C13.2 43.18,47.31 IC1.12
  Bottom 1.27: IC1.12 43.18,42.99 Q1.2
N$68
  Bottom 0.813: C19.1 83.19,29.53 84.05,28.67 IC5.8
N$69
  Bottom 0.813: IC5.1 C19.2 | R8.1 68.9,26.67 70.17,27.94 74.93,27.94
  Bottom 1.778: X2.1 72.39,5.71 74.93,8.25 74.93,27.94 74.93,36.83 78.67,40.57 IC5.1
N$70
  Bottom 0.813: IC6.1 54.93,22.54 55.56,21.91 57.47,20 R12.2
N$72
  Bottom 0.813: 65.72,28.58 R13.1 65.72,36.19 C23.+ | 65.72,28.58 61.28,28.58 60.01,29.85 IC6.6 | D6.C 66.04,17.46 67.31,18.73 67.31,26.99 65.72,28.58
N$73
  Bottom 0.813: D6.A R12.1
N$74
  Top 0.813: X8.2 13.97,73.98 8.57,68.58 8.57,63.18 9.53,62.23 9.53,50.48 6.99,47.94 6.99,30.48 4.44,27.94 X5.5
  Bottom 0.813: T1.C 14.61,27.31 12.7,25.4 RN4.5 X5.5
  Bottom 1.27: X8.2 X8.4 X8.6 X8.8 X8.10
N$75
  Top 0.813: X8.12 27.94,74.93 26.99,75.88 13.97,75.88 7.3,69.22 7.3,62.55 8.26,61.59 8.26,51.12 1.91,44.77 1.91,23.81 2.86,22.86 X5.4
  Bottom 0.813: T2.C 14.61,23.49 13.97,22.86 RN4.4 X5.4
  Bottom 1.27: X8.12 X8.14 X8.16 X8.18 X8.20
N$76
  Top 0.813: X9.2 40.96,73.98 40,73.03 40,70.48 39.05,69.53 11.43,69.53 9.84,67.95 9.84,63.82 10.79,62.87 10.79,49.85 8.26,47.31 8.26,29.85 6.99,28.58 6.99,20.96 6.35,20.32 X5.3
  Bottom 0.813: X5.3 RN4.3 13.97,20.32 14.61,19.69 T3.C
  Bottom 1.27: X9.2 X9.4 X9.6 X9.8 X9.10
N$77
  Bottom 0.813: R15.1 26.35,37.47 17.46,37.47 D2.A
SENSE
  Top 0.813: R11.2 81.28,14.92 85.09,18.73 RL2.2
  Bottom 1.778: 85.72,18.73 85.72,13.97 86.68,13.02 RL1.2 | IC5.10 85.72,18.73 | 85.72,18.73 RL2.2
V+
  Bottom 1.778: 78.11,56.2 C17.1 D5.C 86.36,54.29 IC2.IN 91.44,54.29 97.16,48.58 97.16,29.53 93.34,25.72 93.34,13.97 88.27,8.89 82.87,8.89 80.33,6.35 80.33,3.18 78.74,1.59 36.2,1.59 34.92,2.86 B1.+ | 78.11,56.2 D4.A | C1.+ 74.3,52.39 78.11,56.2

### Text on the board
Top: populate | this side
Bottom: solder | this side | (C) EMM
tPlace: T11-20 | T1-10 | ISP | Led | Group | COM | ~ | ~ | Out1